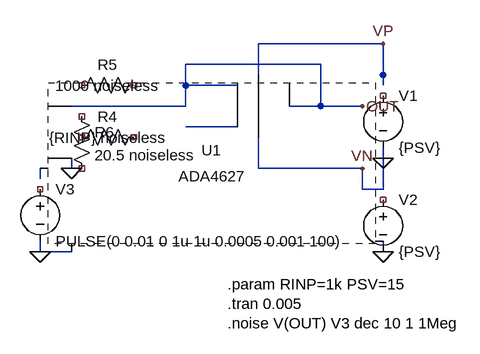
[diagram p0: schematic LTSpice_Amplifier_Noise.asc]
LTSpice_Amplifier_Noise.asc, the LTspice schematic file:
Version 4
SHEET 1 880 680
SYMBOL opamp2 400 128 R0
SYMATTR InstName U1
SYMATTR Value ADA4627
SYMBOL res 272 128 R90
WINDOW 0 0 56 VBottom 2
WINDOW 3 32 56 VBottom 2
SYMATTR InstName R5
SYMATTR Value 1000 noiseless
SYMBOL res 160 176 R0
SYMATTR InstName R6
SYMATTR Value 20.5 noiseless
SYMBOL res 272 208 R90
WINDOW 0 0 56 VBottom 2
WINDOW 3 32 56 VBottom 2
SYMATTR InstName R4
SYMATTR Value {RINP} noiseless
SYMBOL voltage 112 288 R0
SYMATTR InstName V3
SYMATTR Value PULSE(0 0.01 0 1u 1u 0.0005 0.001 100)
SYMATTR Value2 AC 0.01
SYMBOL voltage 640 144 R0
SYMATTR InstName V1
SYMATTR Value {PSV}
SYMBOL voltage 640 304 R0
SYMATTR InstName V2
SYMATTR Value {PSV}
WIRE 416 144 336 144
WIRE 336 144 336 176
WIRE 336 176 160 176
WIRE 416 208 336 208
WIRE 160 256 160 272
WIRE 112 272 112 288
WIRE 112 384 112 400
WIRE 160 400 112 400
WIRE 640 128 640 144
WIRE 640 240 640 256
WIRE 640 256 640 304
WIRE 640 400 640 384
WIRE 496 176 544 176
WIRE 544 176 544 112
WIRE 544 112 336 112
WIRE 336 112 336 144
WIRE 544 176 608 176
WIRE 448 128 448 80
WIRE 448 80 640 80
WIRE 640 80 640 144
WIRE 448 224 448 272
WIRE 448 272 608 272
WIRE 608 272 608 304
WIRE 608 304 640 304
FLAG 160 272 0
FLAG 112 400 0
FLAG 640 256 0
FLAG 640 400 0
FLAG 608 176 OUT
FLAG 640 80 VP
FLAG 608 272 VN
TEXT 400 450 Left 2 !.param RINP=1k PSV=15
TEXT 400 480 Left 2 !.tran 0.005
TEXT 400 510 Left 2 !.noise V(OUT) V3 dec 10 1 1Meg

The netlist it stands for:
* LTSpice_Amplifier_Noise.asc
* U1: ADA4627 (symbol opamp2 not available, pin order unknown); nets seen at it: 0, N001, N002, OUT, VP
R5 NC_01 NC_02 1000 noiseless
R6 NC_03 NC_04 20.5 noiseless
R4 NC_05 NC_06 {RINP} noiseless
V3 NC_07 0 PULSE(0 0.01 0 1u 1u 0.0005 0.001 100) AC 0.01
V1 NC_08 0 {PSV}
V2 NC_09 0 {PSV}
.param RINP=1k PSV=15
.tran 0.005
.noise V(OUT) V3 dec 10 1 1Meg
.backanno
.end